# Altium schematic sheet A7_BLOCKⅠ.SchDoc
size A4
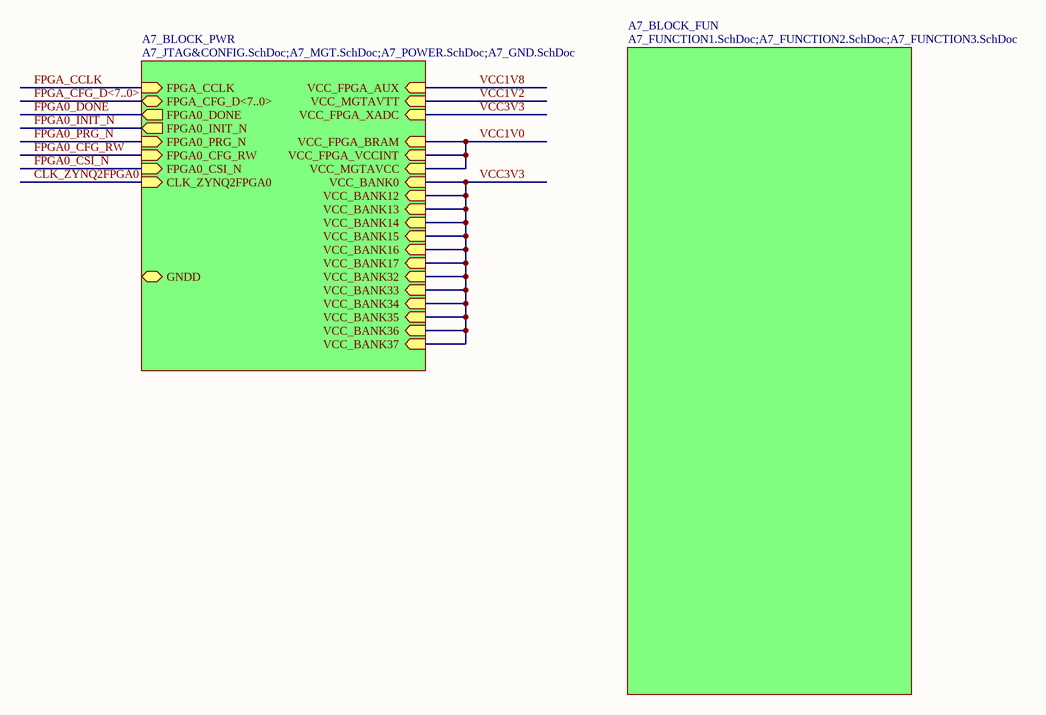
[diagram p0: A7_BLOCKⅠ.SchDoc]

## Sub-sheets
A7_BLOCK_FUN = A7_FUNCTION1.SchDoc;A7_FUNCTION2.SchDoc;A7_FUNCTION3.SchDoc: no entries
A7_BLOCK_PWR = A7_JTAG&CONFIG.SchDoc;A7_MGT.SchDoc;A7_POWER.SchDoc;A7_GND.SchDoc: FPGA_CCLK (in), FPGA0_DONE (out), FPGA0_INIT_N (out), FPGA0_PRG_N (in), GNDD, FPGA_CFG_D<7..0>, CLK_ZYNQ2FPGA0 (in), FPGA0_CFG_RW (in), FPGA0_CSI_N (in), VCC_MGTAVCC (in), VCC_MGTAVTT (in), VCC_BANK0 (in), VCC_FPGA_XADC (in), VCC_FPGA_BRAM (in), VCC_FPGA_VCCINT (in), VCC_FPGA_AUX (in), VCC_BANK12 (in), VCC_BANK13 (in), VCC_BANK14 (in), VCC_BANK15 (in), VCC_BANK16 (in), VCC_BANK17 (in), VCC_BANK32 (in), VCC_BANK33 (in), VCC_BANK34 (in), VCC_BANK35 (in), VCC_BANK36 (in), VCC_BANK37 (in)

## Nets
CLK_ZYNQ2FPGA0: sheet A7_BLOCK_PWR/CLK_ZYNQ2FPGA0
FPGA0_CFG_RW: sheet A7_BLOCK_PWR/FPGA0_CFG_RW
FPGA0_CSI_N: sheet A7_BLOCK_PWR/FPGA0_CSI_N
FPGA0_DONE: sheet A7_BLOCK_PWR/FPGA0_DONE
FPGA0_INIT_N: sheet A7_BLOCK_PWR/FPGA0_INIT_N
FPGA0_PRG_N: sheet A7_BLOCK_PWR/FPGA0_PRG_N
FPGA_CCLK: sheet A7_BLOCK_PWR/FPGA_CCLK
VCC1V0: sheet A7_BLOCK_PWR/VCC_MGTAVCC, sheet A7_BLOCK_PWR/VCC_FPGA_BRAM, sheet A7_BLOCK_PWR/VCC_FPGA_VCCINT
VCC1V2: sheet A7_BLOCK_PWR/VCC_MGTAVTT
VCC1V8: sheet A7_BLOCK_PWR/VCC_FPGA_AUX
VCC3V3: sheet A7_BLOCK_PWR/VCC_BANK0, sheet A7_BLOCK_PWR/VCC_FPGA_XADC, sheet A7_BLOCK_PWR/VCC_BANK12, sheet A7_BLOCK_PWR/VCC_BANK13, sheet A7_BLOCK_PWR/VCC_BANK14, sheet A7_BLOCK_PWR/VCC_BANK15, sheet A7_BLOCK_PWR/VCC_BANK16, sheet A7_BLOCK_PWR/VCC_BANK17, sheet A7_BLOCK_PWR/VCC_BANK32, sheet A7_BLOCK_PWR/VCC_BANK33, sheet A7_BLOCK_PWR/VCC_BANK34, sheet A7_BLOCK_PWR/VCC_BANK35, sheet A7_BLOCK_PWR/VCC_BANK36, sheet A7_BLOCK_PWR/VCC_BANK37

## Buses and harness runs
bus FPGA_CFG_D<7..0> = sheet A7_BLOCK_PWR/FPGA_CFG_D<7..0>